# Altium schematic sheet [5]_MOT_MCU MKV58.SchDoc
size A3; DocumentNumber: 5; SheetNumber: 5; SheetTotal: 12; Ngu?i ki?m tra: bangdd; Ngu?i thi?t k?: thannt114
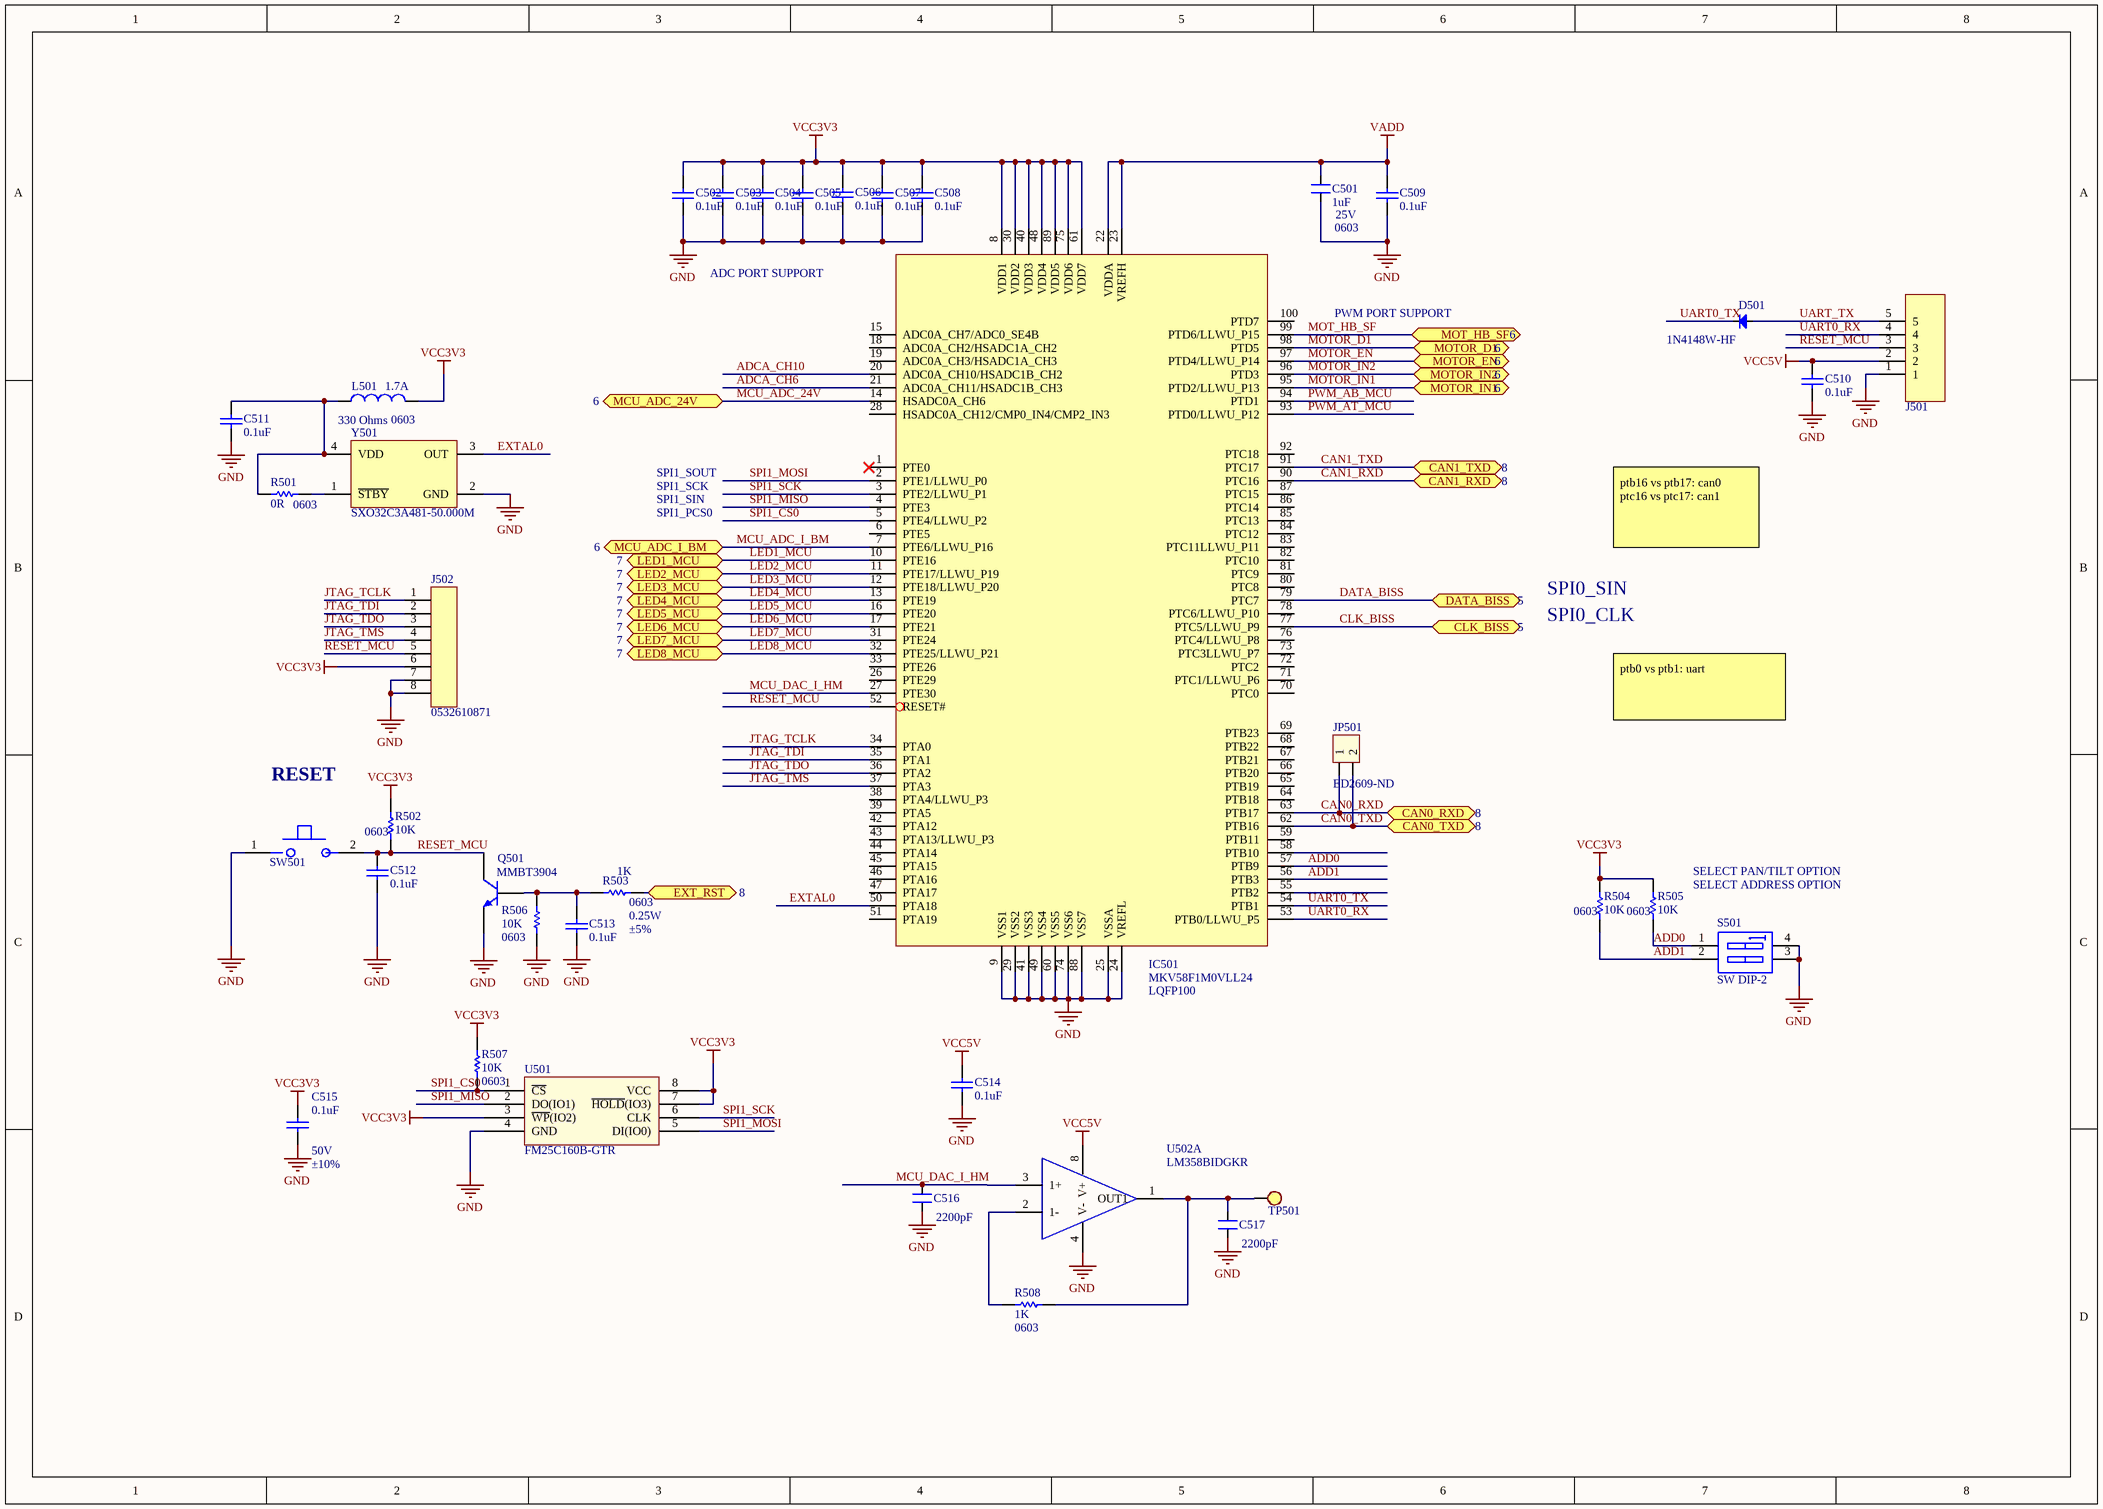
[diagram p0: [5]_MOT_MCU MKV58.SchDoc]

## Parts
C501  PCB FOOTPRINT: 0603  Voltage: 25V  [CAP 0603]  (hidden comment: 1uF)
C502  0.1uF  [CAP 0603]
C503  0.1uF  [CAP 0603]
C504  0.1uF  [CAP 0603]
C505  0.1uF  [CAP 0603]
C506  0.1uF  [CAP 0603]
C507  0.1uF  [CAP 0603]
C508  0.1uF  [CAP 0603]
C509  0.1uF  [CAP 0603]
C510  0.1uF  [CAP 0603]
C511  0.1uF  [CAP 0603]
C512  0.1uF  [CAP 0603]
C513  0.1uF  [CAP 0603]
C514  0.1uF  [CAP 0603]
C515  Voltage: 50V  Tolerance: ±10%  [CAP 0603]  (hidden comment: 0.1uF)
C516  2200pF  [CAP 0603]
C517  2200pF  [CAP 0603]
D501  1N4148W-HF  [DIO-SMD-123]
IC501  MANUFACTURER1_PART#: MKV58F1M0VLL24  PACKAGE: LQFP100  [100-LQFP]  (hidden comment: IC;IC MCU 32BIT 1MB FLASH 100LQFP,100-LQFP,-40TO 105°C,MKV58F1M0VLL24)
J501  HEADER;HEADER 5 POS 2.54MM  [HEADER 5 2.54MM]  (value not drawn)
J502  Manufacturer Part Number: 0532610871  [CONN-8]  (hidden comment: CONN-SMD;CONN HEADER SMD R/A,M,1Rx8Px1.25MM,0532610871)
JP501  ED2609-ND  [MF52A2103J3470]
L501  PCB Footprint: 0603  Current: 1.7A  [FB 0603]  (hidden comment: 330 Ohms)
Q501  MMBT3904  [SOT-23]
R501  PCB Footprint: 0603  [res 0603]  (hidden comment: 0R)  (no BOM)
R502  PCB Footprint: 0603  [res 0603]  (hidden comment: 10K)
R503  PCB Footprint: 0603  Power: 0.25W  Tolerance: ±5%  [res 0603]  (hidden comment: 1K)
R504  PCB Footprint: 0603  [res 0603]  (hidden comment: 10K)
R505  PCB Footprint: 0603  [res 0603]  (hidden comment: 10K)
R506  PCB Footprint: 0603  [res 0603]  (hidden comment: 10K)
R507  PCB Footprint: 0603  [res 0603]  (hidden comment: 10K)
R508  PCB Footprint: 0603  [res 0603]  (hidden comment: 1K)
S501  SW DIP-2  [219-2LPSTR]
SW501  SWITCH;TACTILE SWITCH SPST-NO TOP ACTUATED,2-SMD,MJTP1106STR  [SW]  (value not drawn)
TP501  TP SMD  [TESTPOINT]  (value not drawn)  (no BOM)
U501  FM25C160B-GTR  [SOIC-8 150MIL]
U502  LM358BIDGKR  [8-VSSOP]  (part A of 2)
Y501  SXO32C3A481-50.000M  [DFN210P320X85-4N]

## Ports
CAN0_RXD (bidir, see 8), CAN0_TXD (bidir, see 8), CAN1_RXD (bidir, see 8), CAN1_TXD (bidir, see 8), CLK_BISS (bidir, see 5), DATA_BISS (bidir, see 5), EXT_RST (bidir, see 8), LED1_MCU (bidir, see 7), LED2_MCU (bidir, see 7), LED3_MCU (bidir, see 7), LED4_MCU (bidir, see 7), LED5_MCU (bidir, see 7), LED6_MCU (bidir, see 7), LED7_MCU (bidir, see 7), LED8_MCU (bidir, see 7), MCU_ADC_24V (bidir, see 6), MCU_ADC_I_BM (bidir, see 6), MOT_HB_SF (bidir, see 6), MOTOR_D1 (bidir, see 6), MOTOR_EN (bidir, see 6), MOTOR_IN1 (bidir, see 6), MOTOR_IN2 (bidir, see 6)

## Nets
GND: C501.2 C502.2 C503.2 C504.2 C505.2 C506.2 C507.2 C508.2 C509.2 C510.2 C511.2 C512.2 C513.2 C514.1 C515.2 C516.2 C517.2 IC501.9(VSS1) IC501.24(VREFL) IC501.25(VSSA) IC501.29(VSS2) IC501.41(VSS3) IC501.49(VSS4) IC501.60(VSS5) IC501.74(VSS6) IC501.88(VSS7) J501.1 J502.7 J502.8 Q501.2(E) R506.2 S501.3(B2) S501.4(B1) SW501.1 U501.4(GND) U502.4(V-) Y501.2(GND)
VADD: C501.1 C509.1 IC501.22(VDDA) IC501.23(VREFH)
VCC3V3: C502.1 C503.1 C504.1 C505.1 C506.1 C507.1 C508.1 C515.1 IC501.8(VDD1) IC501.30(VDD2) IC501.40(VDD3) IC501.48(VDD4) IC501.61(VDD7) IC501.75(VDD6) IC501.89(VDD5) J502.6 L501.2 R502.1 R504.1 R505.1 R507.1 U501.3(~{WP}(IO2)) U501.7(~{HOLD}(IO3)) U501.8(VCC)
VCC5V: C510.1 C514.2 J501.2 U502.8(V+)
ADCA_CH6: IC501.21(ADC0A_CH11/HSADC1B_CH3)
ADCA_CH10: IC501.20(ADC0A_CH10/HSADC1B_CH2)
ADD0: IC501.57(PTB9) R505.2 S501.1(A1)
ADD1: IC501.56(PTB3) R504.2 S501.2(A2)
CAN0_RXD: IC501.63(PTB17) JP501.1 ; port CAN0_RXD
CAN0_TXD: IC501.62(PTB16) JP501.2 ; port CAN0_TXD
CAN1_RXD: IC501.90(PTC16) ; port CAN1_RXD
CAN1_TXD: IC501.91(PTC17) ; port CAN1_TXD
CLK_BISS: IC501.77(PTC5/LLWU_P9) ; port CLK_BISS
DATA_BISS: IC501.79(PTC7) ; port DATA_BISS
EXT_RST: R503.1 ; port EXT_RST
EXTAL0: IC501.50(PTA18) Y501.3(OUT)
JTAG_TCLK: IC501.34(PTA0) J502.1
JTAG_TDI: IC501.35(PTA1) J502.2
JTAG_TDO: IC501.36(PTA2) J502.3
JTAG_TMS: IC501.37(PTA3) J502.4
LED1_MCU: IC501.10(PTE16) ; port LED1_MCU
LED2_MCU: IC501.11(PTE17/LLWU_P19) ; port LED2_MCU
LED3_MCU: IC501.12(PTE18/LLWU_P20) ; port LED3_MCU
LED4_MCU: IC501.13(PTE19) ; port LED4_MCU
LED5_MCU: IC501.16(PTE20) ; port LED5_MCU
LED6_MCU: IC501.17(PTE21) ; port LED6_MCU
LED7_MCU: IC501.31(PTE24) ; port LED7_MCU
LED8_MCU: IC501.32(PTE25/LLWU_P21) ; port LED8_MCU
MCU_ADC_24V: IC501.14(HSADC0A_CH6) ; port MCU_ADC_24V
MCU_ADC_I_BM: IC501.7(PTE6/LLWU_P16) ; port MCU_ADC_I_BM
MCU_DAC_I_HM: C516.1 IC501.27(PTE30) U502.3(1+)
MOT_HB_SF: IC501.99(PTD6/LLWU_P15) ; port MOT_HB_SF
MOTOR_D1: IC501.98(PTD5) ; port MOTOR_D1
MOTOR_EN: IC501.97(PTD4/LLWU_P14) ; port MOTOR_EN
MOTOR_IN1: IC501.95(PTD2/LLWU_P13) ; port MOTOR_IN1
MOTOR_IN2: IC501.96(PTD3) ; port MOTOR_IN2
PWM_AB_MCU: IC501.94(PTD1)
PWM_AT_MCU: IC501.93(PTD0/LLWU_P12)
RESET_MCU: C512.1 IC501.52(RESET#) J501.3 J502.5 Q501.3(C) R502.2 SW501.2
SPI1_CS0: IC501.5(PTE4/LLWU_P2) R507.2 U501.1(~{CS})
SPI1_MISO: IC501.4(PTE3) U501.2(DO(IO1))
SPI1_MOSI: IC501.2(PTE1/LLWU_P0) U501.5(DI(IO0))
SPI1_SCK: IC501.3(PTE2/LLWU_P1) U501.6(CLK)
UART0_RX: IC501.53(PTB0/LLWU_P5) J501.4
UART0_TX: D501.2(K) IC501.54(PTB1)
UART_TX: D501.1(A) J501.5
NetC511_1: C511.1 L501.1 R501.1 Y501.4(VDD)
NetC513_1: C513.1 Q501.1(B) R503.2 R506.1
NetC517_1: C517.1 R508.2 TP501.1 U502.1(OUT1)
NetR501_2: R501.2 Y501.1(~{STBY})
NetR508_1: R508.1 U502.2(1-)

Not connected (* = marked no-connect by the designer): IC501 1(PTE0)* 6(PTE5) 15(ADC0A_CH7/ADC0_SE4B) 18(ADC0A_CH2/HSADC1A_CH2) 19(ADC0A_CH3/HSADC1A_CH3) 26(PTE29) 28(HSADC0A_CH12/CMP0_IN4/CMP2_IN3) 33(PTE26) 38(PTA4/LLWU_P3) 39(PTA5) 42(PTA12) 43(PTA13/LLWU_P3) 44(PTA14) 45(PTA15) 46(PTA16) 47(PTA17) 51(PTA19) 55(PTB2) 58(PTB10) 59(PTB11) 64(PTB18) 65(PTB19) 66(PTB20) 67(PTB21) 68(PTB22) 69(PTB23) 70(PTC0) 71(PTC1/LLWU_P6) 72(PTC2) 73(PTC3LLWU_P7) 76(PTC4/LLWU_P8) 78(PTC6/LLWU_P10) 80(PTC8) 81(PTC9) 82(PTC10) 83(PTC11LLWU_P11) 84(PTC12) 85(PTC13) 86(PTC14) 87(PTC15) 92(PTC18) 100(PTD7)

## Notes on the sheet
- ADC PORT SUPPORT
- PWM PORT SUPPORT
- SPI1_SOUT
- SPI1_SCK
- SPI1_SIN
- SPI1_PCS0
- ptb16 vs ptb17: can0
  ptc16 vs ptc17: can1
- SPI0_SIN
- SPI0_CLK
- ptb0 vs ptb1: uart
- RESET
- SELECT PAN/TILT OPTION
- SELECT ADDRESS OPTION

## Library data of the parts
C501 = Cap_1uF: CAP CER 1UF 25V X7R 0603; MANUFACTURER1: Samsung Electro-Mechanics; MANUFACTURER1_PART#: CL10A105KA8NNNC; MANUFACTURER2_PART#: TMK107B7105KA-T; PACKING: TR; UNIT: PCS; Material: X5R; Process Type: SM; Tolerance: 10%; Value: 1uF; CATEGORY: CAP CER; PCB_ Footprint: 0603; MANUFACTURER2: Taiyo Yuden; LOH_Code: *
C502-C514 = Cap: CAP-CER,SMD;0.1UF,10%,50V,X7R,0603; MANUFACTURER1: Samsung Electro-Mechanics; MANUFACTURER1_PART#: CL10B104KB8NNNC; MANUFACTURER2_PART#: M0603X104K050TAX; MANUFACTURER1: SS; Unit: PCS; PACKING: Tape & Reel (TR); PCB FOOTPRINT: 0603; Process Type: SM; CATEGORY: CAP-CER; VALUE: 0.1uF; FOOTPRINT: 0603; Material: X7R; Voltage: 50V; Tolerance: ±10%; MANUFACTURER2: UWA
C515 = Cap: CAP-CER,SMD;0.1UF,10%,50V,X7R,0603; MANUFACTURER1: Samsung Electro-Mechanics; MANUFACTURER1_PART#: CL10B104KB8NNNC; MANUFACTURER2_PART#: M0603X104K050TAX; MANUFACTURER1: SS; Unit: PCS; PACKING: Tape & Reel (TR); PCB FOOTPRINT: 0603; Process Type: SM; LOH_Code: 101100038; CATEGORY: CAP-CER; VALUE: 0.1uF; FOOTPRINT: 0603; Material: X7R; MANUFACTURER2: UWA
C516 C517 = CN: CAP CER 2200PF 50V X7R 0603; MANUFACTURER1: Samsung Electro-Mechanics; MANUFACTURER1_PART#: CL10B222KB8NFNC; PACKING: TR; PCB FOOTPRINT: 0603; PROCESS_TYPE: SMT; Tolerance: ±10%; Value: 2200pF; CATEGORY: CAP CER; Voltage - Rated: 50V; Temperature Coefficient: X7R
D501 = Diode SMD: Default Diode; MANUFACTURER1: Comchip; VOLTAGE: 75V; CURRENT: 150mA; MANUFACTURER1_PART#: 1N4148W-HF; Value: 1N4148W-HF
IC501 = IC;IC MCU 32BIT 1MB FLASH 100LQFP,100-LQFP,-40TO 105°C,MKV58F1M0VLL24: IC MCU 32BIT 1MB FLASH 100LQFP; Manufacturer: NXP USA Inc.; Manufacturer Part Number: MKV58F1M0VLL24; Category: IC; MANUFACTURER1: NXP USA Inc.
J501 = HEADER;HEADER 5 POS 2.54MM: HEADER 5 POS 2.54MM; MANUFACTURER1: LKCL; MANUFACTURER1_PART#: XH2.54-5P
J502 = CONN-SMD;CONN HEADER SMD R/A,M,1Rx8Px1.25MM,0532610871: CONN HEADER SMD R/A 8POS 1.25MM; MANUFACTURER1: Molex; Category: CONN; MANUFACTURER1_PART#: 0532610871
JP501 = Con2: 2 Position Wire to Board Terminal Block Horizontal with Board 0.200" (5.08mm) Through Hole; Value: Connector 2; Digikey: ED2609-ND
L501 = inductor 2.2uF: FERRITE BEAD 330 OHM 0603 1LN; MANUFACTURER1: TDK Corporation; MANUFACTURER1_PART#: MPZ1608S331ATA00; MANUFACTURER2_PART#: BLM18KG331SN1D; PACKING: Tape & Reel (TR); Process Type: SM; Unit: PCS; Tolerance: ±10%; Category: Inductor; DESCRIPTION_: FERRITE BEAD 330 OHM 0603 1LN; MANUFACTURER2: Murata Electronics; Value: 330 Ohms
Q501 = NPN: NPN 200mA 40V 350mW SOT-23 Transistors; MANUFACTURER1: Guangdong Hottech; PROCESS_TYPE: SM; PACKAGE: SOT23; Category: TRANSISTOR; MANUFACTURER2: HT(Shenzhen Jinyu Semicon); MANUFACTURER2_PART#: MMBT3904; MANUFACTURER1_PART#: MMBT3904; Value: MMBT3904
R501 = Res0.3: RES SMD 0 OHM JUMPER 1/10W 0603; MANUFACTURER1: Yageo; MANUFACTURER1_PART#: RC0603JR-070RL; MANUFACTURER2_PART#: RMCF0603ZT0R00; PACKING: Tape & Reel (TR); Process Type: SM; Unit: PCS; Power: 0.25W; Tolerance: 5%; Value: 0R; CATEGORY: RES SMD; MANUFACTURER2: Stackpole Electronics Inc
R502 R504-R507 = Res0.3: RES SMD,10K OHM 5% 1/10W 0603; MANUFACTURER1: Stackpole Electronics Inc; MANUFACTURER1_PART#: RMCF0603JT10K0; MANUFACTURER2_PART#: R0603J10KKDX; PACKING: Tape & Reel (TR); Process Type: SM; Unit: PCS; Power: 0.25W; Value: 10K; CATEGORY: RES-SMD; MANUFACTURER2: UWA; Tolerance: ±5%
R503 = Res0.3: RES SMD,1K OHM,5%,1/10W,0603; MANUFACTURER1: Stackpole Electronics Inc; MANUFACTURER1_PART#: RMCF06031K00JNEAC; MANUFACTURER2_PART#: R0603J1KTG; DESCCRIPTION: RES SMD 1K OHM 5% 1/10W 0603; PACKING: Tape & Reel (TR); Process Type: SM; Unit: PCS; LOH_Code: 140100083; Value: 1K; CATEGORY: RES SMD; MANUFACTURER2: UWA
R508 = Res0.3: RES SMD,1K OHM,5%,1/10W,0603; MANUFACTURER1: Stackpole Electronics Inc; MANUFACTURER1_PART#: RMCF06031K00JNEAC; MANUFACTURER2_PART#: R0603J1KTG; DESCCRIPTION: RES SMD 1K OHM 5% 1/10W 0603; PACKING: Tape & Reel (TR); Process Type: SM; Unit: PCS; LOH_Code: 140100083; Power: 0.25W; Value: 1K; CATEGORY: RES SMD; MANUFACTURER2: UWA; Tolerance: ±5%
S501 = SW DIP-2: DIP SWITCH, SPST, 2.54 PITCH, F; MANUFACTURER1_PART#: DS04-254-2-02BK-SMT; MANUFACTURER1: CUI; PRICE: 0.48800; CATEGORY: SWITCH; LINK: https://www.digikey.com/en/products/detail/cui-devices/DS04-254-2-02BK-SMT/11310860
SW501 = SWITCH;TACTILE SWITCH SPST-NO TOP ACTUATED,2-SMD,MJTP1106STR: SWITCH TACTILE SPST-NO 0.05A 12V; MANUFACTURER1: APEM Inc.; Manufacturer Part Number: MJTP1106STR; Category: BUTTON; MANUFACTURER1_PART#: MJTP1106STR
TP501 = TP SMD: TEST POINT
U501 = IC Flash W25Q16JVSNIQ QUAD SO8: IC FRAM 16KBIT SPI 20MHZ 8SOIC; MANUFACTURER1: Cypress; PACKING: Tape & Reel (TR); PCB Footprint: SO8; Process Type: SM; Unit: PCS; Voltage: 2.7V ~ 3.6V; Category: IC; MANUFACTURER1_PART#: FM25C160B-GTR; Value: FM25C160B-GTR
U502 = LM358BIDGKR: IC OPAMP GP 2 CIRCUIT 8VSSOP; Manufacturer Part Number: LM358BIDGKR
Y501 = OSCILLATOR;50MHZ,50ppm,3.2x2.5mm,ASEMB-50.000MHZ-LC-T: MEMS OSC XO 50.0000MHZ CMOS SMD; MANUFACTURER1: Suntsu; Manufacturer Part Number: SXO32C3A481-50.000M; MANUFACTURER1_PART#: SXO32C3A481-50.000M; VALUE: SXO32C3A481-50.000M